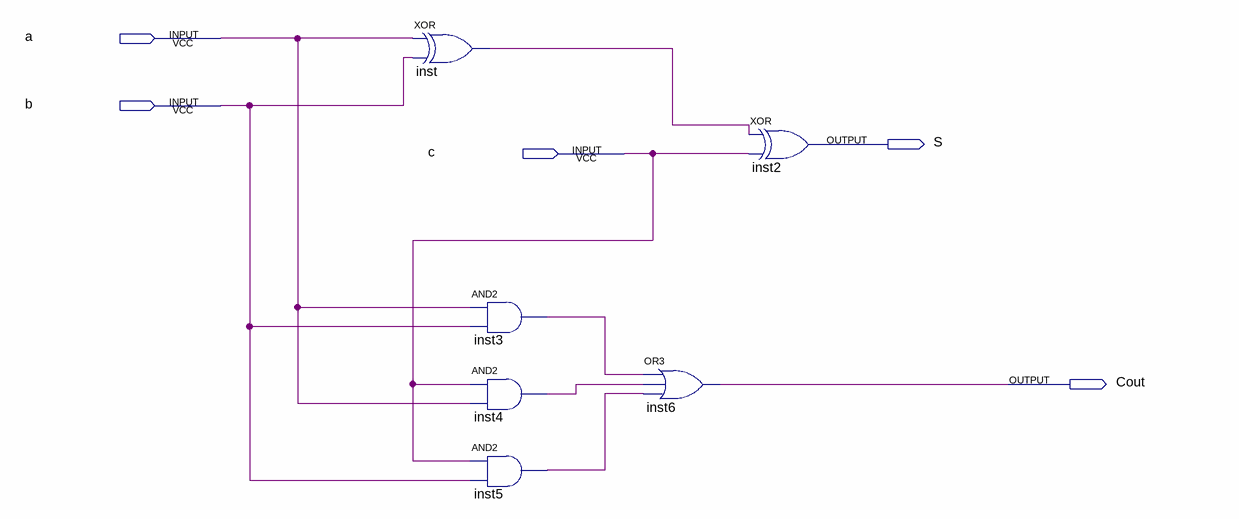
[diagram p0: schematic sheet]
// Quartus schematic FullAdder.bdf as structural Verilog: 6 symbols, 5 pins
module FullAdder (
  input  a,
  input  b,
  input  c,
  output S,
  output Cout
);

  wire inst3_out, inst4_out, inst5_out, inst_out;

  xor inst (inst_out, a, b);
  and inst3 (inst3_out, a, b);
  and inst4 (inst4_out, c, a);
  and inst5 (inst5_out, c, b);
  or inst6 (Cout, inst3_out, inst4_out, inst5_out);
  xor inst2 (S, inst_out, c);
endmodule
